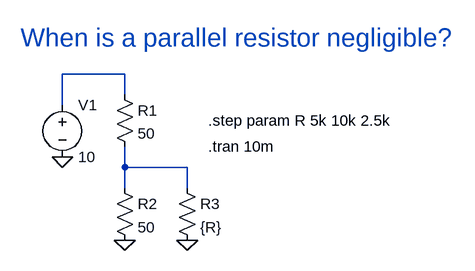
[diagram p0: schematic Parallel-resistor-when-negligible.asc]
Parallel-resistor-when-negligible.asc, the LTspice schematic file:
Version 4.1
SHEET 1 880 680
WIRE 80 32 -16 32
WIRE 80 64 80 32
WIRE -16 80 -16 32
WIRE 80 176 80 144
WIRE 176 176 80 176
WIRE 80 208 80 176
WIRE 176 208 176 176
FLAG 80 288 0
FLAG 176 288 0
FLAG -16 160 0
SYMBOL res 64 48 R0
SYMATTR InstName R1
SYMATTR Value 50
SYMBOL res 64 192 R0
SYMATTR InstName R2
SYMATTR Value 50
SYMBOL res 160 192 R0
SYMATTR InstName R3
SYMATTR Value {R}
SYMBOL voltage -16 64 R0
WINDOW 123 0 0 Left 2
WINDOW 39 0 0 Left 2
SYMATTR InstName V1
SYMATTR Value 10
TEXT 208 104 Left 2 !.step param R 5k 10k 2.5k
TEXT 208 144 Left 2 !.tran 10m
TEXT -80 -24 Left 4 ;When is a parallel resistor negligible?

The netlist it stands for:
* Parallel-resistor-when-negligible.asc
R1 N001 N002 50
R2 N002 0 50
R3 N002 0 {R}
V1 N001 0 10
.step param R 5k 10k 2.5k
.tran 10m
* When is a parallel resistor negligible?
.backanno
.end